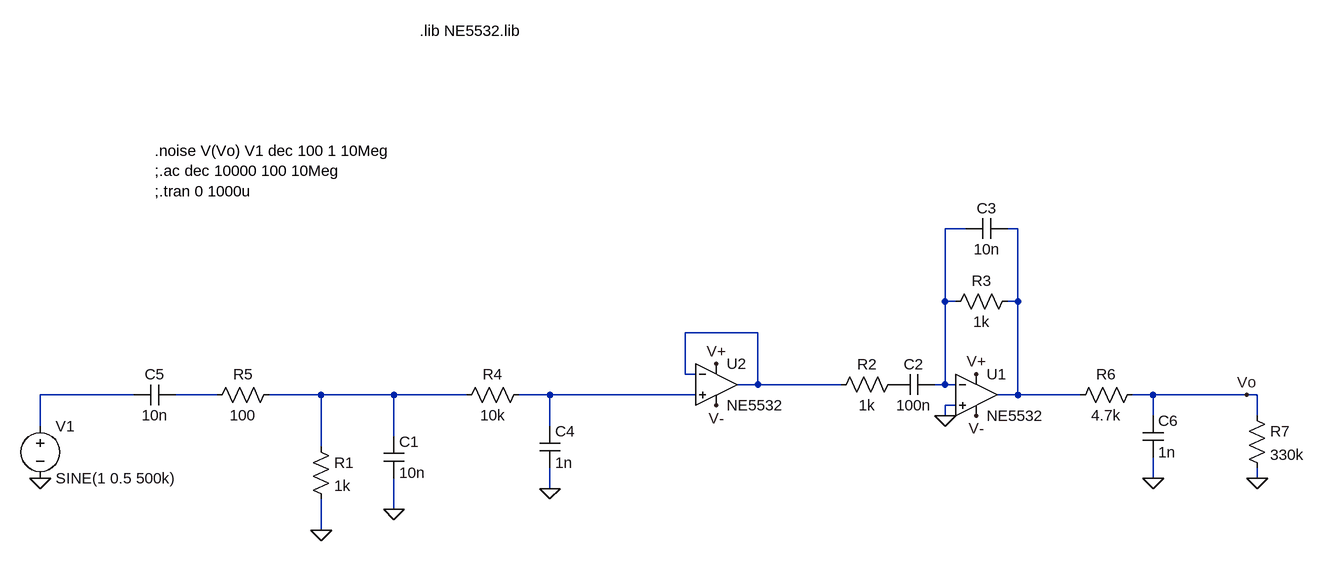
[diagram p0: schematic 2026-01-02_rx.asc]
2026-01-02_rx.asc, the LTspice schematic file:
Version 4
SHEET 1 1628 680
WIRE 928 96 896 96
WIRE 1008 96 992 96
WIRE 896 208 896 96
WIRE 912 208 896 208
WIRE 1008 208 1008 96
WIRE 1008 208 992 208
WIRE 608 256 496 256
WIRE 496 320 496 256
WIRE 512 320 496 320
WIRE 608 336 608 256
WIRE 608 336 576 336
WIRE 736 336 608 336
WIRE 896 336 896 208
WIRE 896 336 880 336
WIRE 912 336 896 336
WIRE -352 352 -496 352
WIRE -224 352 -288 352
WIRE -64 352 -144 352
WIRE 48 352 -64 352
WIRE 160 352 48 352
WIRE 288 352 240 352
WIRE 512 352 288 352
WIRE 1008 352 1008 208
WIRE 1008 352 976 352
WIRE 1104 352 1008 352
WIRE 1216 352 1184 352
WIRE 1360 352 1216 352
WIRE 1376 352 1360 352
WIRE 912 368 896 368
WIRE 896 384 896 368
WIRE 1216 384 1216 352
WIRE 1376 384 1376 352
WIRE -496 400 -496 352
WIRE 288 400 288 352
WIRE 48 416 48 352
WIRE -64 432 -64 352
WIRE 1216 480 1216 448
WIRE 1376 480 1376 464
WIRE 288 496 288 464
WIRE 48 528 48 480
WIRE -64 560 -64 512
FLAG -64 560 0
FLAG 48 528 0
FLAG 944 320 V+
FLAG 944 384 V-
FLAG 896 384 0
FLAG 544 304 V+
FLAG 544 368 V-
FLAG 288 496 0
FLAG -496 480 0
FLAG 1360 352 Vo
FLAG 1216 480 0
FLAG 1376 480 0
SYMBOL Res -80 416 R0
SYMATTR InstName R1
SYMATTR Value 1k
SYMBOL Cap 32 416 R0
SYMATTR InstName C1
SYMATTR Value 10n
SYMBOL OpAmps/opamp2 944 288 R0
SYMATTR InstName U1
SYMATTR Value NE5532
SYMBOL Res 832 320 R90
WINDOW 0 0 56 VBottom 2
WINDOW 3 32 56 VTop 2
SYMATTR InstName R2
SYMATTR Value 1k
SYMBOL Cap 880 320 R90
WINDOW 0 0 32 VBottom 2
WINDOW 3 32 32 VTop 2
SYMATTR InstName C2
SYMATTR Value 100n
SYMBOL Res 1008 192 R90
WINDOW 0 0 56 VBottom 2
WINDOW 3 32 56 VTop 2
SYMATTR InstName R3
SYMATTR Value 1k
SYMBOL OpAmps/opamp2 544 272 R0
SYMATTR InstName U2
SYMATTR Value NE5532
SYMBOL Cap 992 80 R90
WINDOW 0 0 32 VBottom 2
WINDOW 3 32 32 VTop 2
SYMATTR InstName C3
SYMATTR Value 10n
SYMBOL Res 256 336 R90
WINDOW 0 0 56 VBottom 2
WINDOW 3 32 56 VTop 2
SYMATTR InstName R4
SYMATTR Value 10k
SYMBOL Cap 272 400 R0
SYMATTR InstName C4
SYMATTR Value 1n
SYMBOL Voltage -496 384 R0
SYMATTR InstName V1
SYMATTR Value SINE(1 0.5 500k)
SYMATTR Value2 AC 1
SYMBOL Cap -288 336 R90
WINDOW 0 0 32 VBottom 2
WINDOW 3 32 32 VTop 2
SYMATTR InstName C5
SYMATTR Value 10n
SYMBOL Res -128 336 R90
WINDOW 0 0 56 VBottom 2
WINDOW 3 32 56 VTop 2
SYMATTR InstName R5
SYMATTR Value 100
SYMBOL Res 1200 336 R90
WINDOW 0 0 56 VBottom 2
WINDOW 3 32 56 VTop 2
SYMATTR InstName R6
SYMATTR Value 4.7k
SYMBOL Cap 1200 384 R0
SYMATTR InstName C6
SYMATTR Value 1n
SYMBOL Res 1360 368 R0
SYMATTR InstName R7
SYMATTR Value 330k
TEXT 88 -208 Left 2 !.lib NE5532.lib
TEXT -320 -24 Left 2 !.noise V(Vo) V1 dec 100 1 10Meg\n;.ac dec 10000 100 10Meg\n;.tran 0 1000u

The netlist it stands for:
* 2026-01-02_rx.asc
R1 N006 0 1k
C1 N006 0 10n
XU1 0 N001 V+ V- N002 NE5532  ; pins In+ In- V+ V- OUT
R2 P001 N003 1k
C2 N001 P001 100n
R3 N002 N001 1k
XU2 N007 N003 V+ V- N003 NE5532  ; pins In+ In- V+ V- OUT
C3 N002 N001 10n
R4 N007 N006 10k
C4 N007 0 1n
V1 N004 0 SINE(1 0.5 500k) AC 1
C5 N005 N004 10n
R5 N006 N005 100
R6 Vo N002 4.7k
C6 Vo 0 1n
R7 Vo 0 330k
.lib NE5532.lib
.noise V(Vo) V1 dec 100 1 10Meg
;.ac dec 10000 100 10Meg
;.tran 0 1000u
.backanno
.end